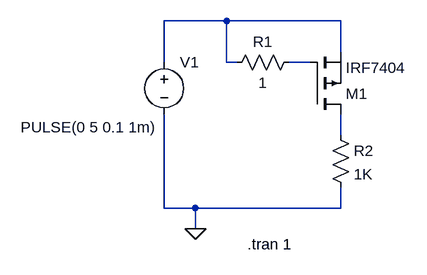
[diagram p0: schematic Draft1.asc]
Draft1.asc, the LTspice schematic file:
Version 4
SHEET 1 880 680
WIRE 336 176 240 176
WIRE 512 176 336 176
WIRE 512 224 512 176
WIRE 240 240 240 176
WIRE 336 240 336 176
WIRE 352 240 336 240
WIRE 464 240 432 240
WIRE 512 352 512 320
WIRE 240 464 240 320
WIRE 288 464 240 464
WIRE 512 464 512 432
WIRE 512 464 288 464
WIRE 288 496 288 464
FLAG 288 496 0
SYMBOL pmos 464 320 M180
SYMATTR InstName M1
SYMATTR Value IRF7404
SYMBOL res 448 224 R90
WINDOW 0 0 56 VBottom 2
WINDOW 3 32 56 VTop 2
SYMATTR InstName R1
SYMATTR Value 1
SYMBOL voltage 240 224 R0
WINDOW 3 -221 116 Left 2
SYMATTR InstName V1
SYMATTR Value PULSE(0 5 0.1 1m)
SYMBOL res 496 336 R0
SYMATTR InstName R2
SYMATTR Value 1K
TEXT 368 520 Left 2 !.tran 1

The netlist it stands for:
* Draft1.asc
M1 N003 N002 N001 N001 IRF7404
R1 N002 N001 1
V1 N001 0 PULSE(0 5 0.1 1m)
R2 N003 0 1K
.model NMOS NMOS
.model PMOS PMOS
.lib standard.mos
.tran 1
.backanno
.end